# EAGLE design mainboard (EAGLE 6.4)
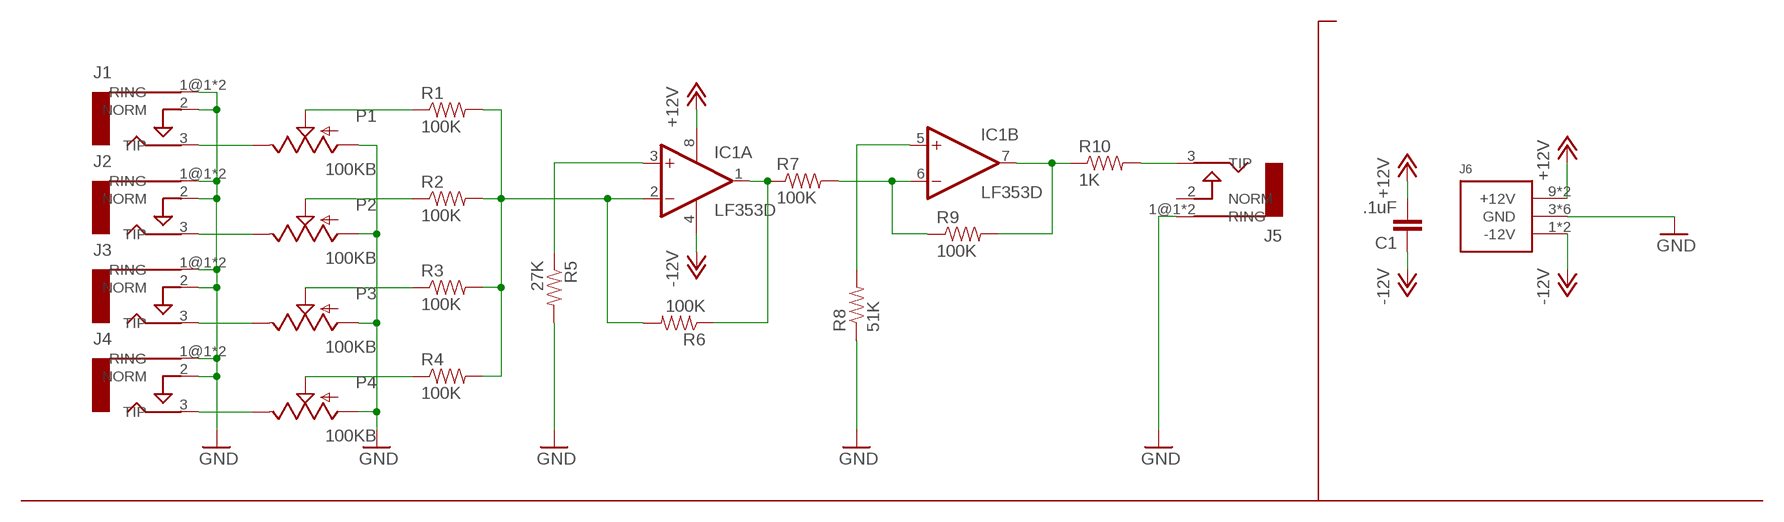
[diagram p0: schematic, sheet 1]

## Parts
C1  .1uF  CAP0603-CAP  [0603-CAP]
IC1  LF353D  [SO08]
J1  AUDIO-JACKERTHENVAR  [ERTHENVAR-JACK]
J2  AUDIO-JACKERTHENVAR  [ERTHENVAR-JACK]
J3  AUDIO-JACKERTHENVAR  [ERTHENVAR-JACK]
J4  AUDIO-JACKERTHENVAR  [ERTHENVAR-JACK]
J5  AUDIO-JACKERTHENVAR  [ERTHENVAR-JACK]
J6  POWER_SIMPLE16  [POWER_16]
P1  100KB  POTPDB12  [PDB12]
P2  100KB  POTPDB12  [PDB12]
P3  100KB  POTPDB12  [PDB12]
P4  100KB  POTPDB12  [PDB12]
R1  100K  1.2MOHMS-1/10W-1%(0603)  [0603-RES]
R2  100K  1.2MOHMS-1/10W-1%(0603)  [0603-RES]
R3  100K  1.2MOHMS-1/10W-1%(0603)  [0603-RES]
R4  100K  1.2MOHMS-1/10W-1%(0603)  [0603-RES]
R5  27K  1.2MOHMS-1/10W-1%(0603)  [0603-RES]
R6  100K  1.2MOHMS-1/10W-1%(0603)  [0603-RES]
R7  100K  1.2MOHMS-1/10W-1%(0603)  [0603-RES]
R8  51K  1.2MOHMS-1/10W-1%(0603)  [0603-RES]
R9  100K  1.2MOHMS-1/10W-1%(0603)  [0603-RES]
R10  1K  1.2MOHMS-1/10W-1%(0603)  [0603-RES]

## Nets
+12V: C1.2 IC1.8(P:V+) J6.9(+12V) J6.10(+12V)
-12V: C1.1 IC1.4(P:V-) J6.1(-12V) J6.2(-12V)
GND: J1.1@1(RING) J1.1@2(RING) J1.2(NORM) J2.1@1(RING) J2.1@2(RING) J2.2(NORM) J3.1@1(RING) J3.1@2(RING) J3.2(NORM) J4.1@1(RING) J4.1@2(RING) J4.2(NORM) J5.1@1(RING) J5.1@2(RING) J6.3(GND) J6.4(GND) J6.5(GND) J6.6(GND) J6.7(GND) J6.8(GND) P1.1(A) P2.1(A) P3.1(A) P4.1(A) R5.2 R8.1
J1: J1.3(TIP) P1.3(E)
N$1: J3.3(TIP) P3.3(E)
N$2: J2.3(TIP) P2.3(E)
N$3: J5.3(TIP) R10.2
N$4: P1.2(S) R1.1
N$5: P2.2(S) R2.1
N$6: J4.3(TIP) P4.3(E)
N$7: P3.2(S) R3.1
N$8: IC1.1(A:OUT) R6.1 R7.1
N$9: IC1.3(A:+IN) R5.1
N$10: P4.2(S) R4.1
N$11: IC1.2(A:-IN) R1.2 R2.2 R3.2 R4.2 R6.2
N$12: IC1.7(B:OUT) R9.2 R10.1
N$14: IC1.6(B:-IN) R7.2 R9.1
N$15: IC1.5(B:+IN) R8.2
Unconnected: J5.2(NORM)

## Library data of the parts
C1 = SparkFun:CAP: Capacitor Standard 0603 ceramic capacitor, and 0.1" leaded capacitor.
IC1 = linear:LF353: OP AMP
J1-J5 = erthenvar:AUDIO-JACK: Switching Mono 3.5mm Audio Jack from Erthenvar.
J6 = eurorack:POWER_SIMPLE
P1-P4 = SparkFun:POT
R1-R10 = SparkFun-Resistors:1.2MOHMS-1/10W-1%(0603): RES-10055; PROD_ID: RES-10055; VALUE: 1.2M

## Board
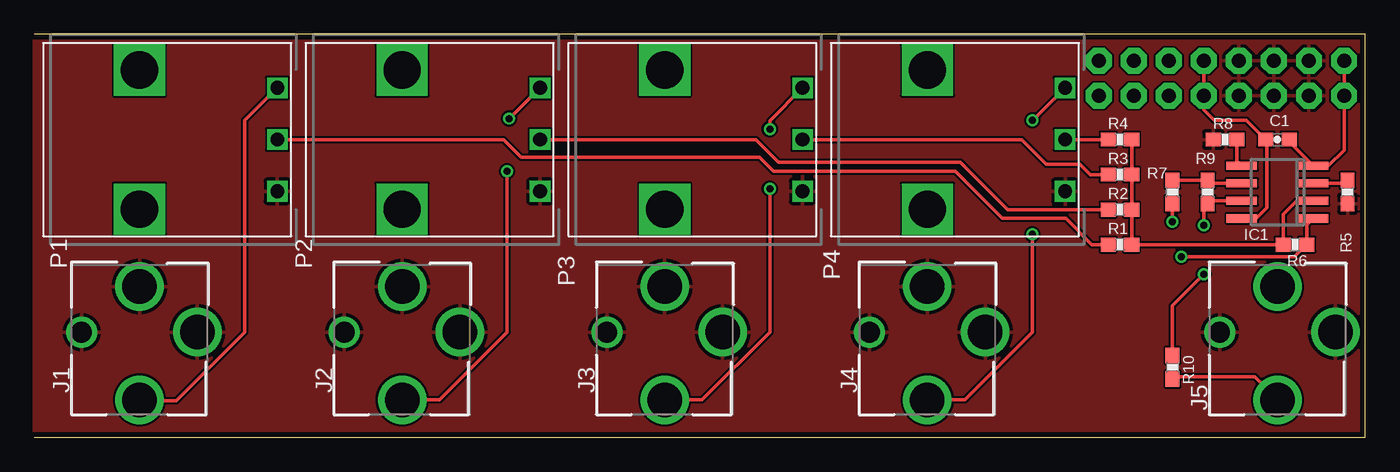
[diagram p1: board, top side]
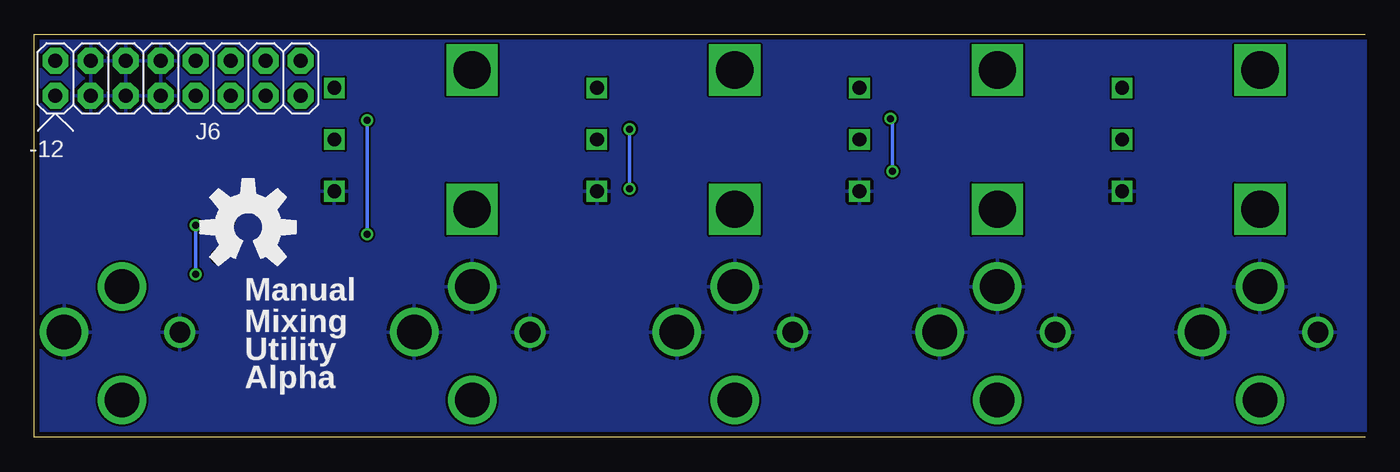
[diagram p2: board, bottom side, seen from below]

Size 96.52 x 29.21 mm. Coordinates in mm from the lower left corner, seen from the top.
Outline: 0,0 96.52,0 96.52,29.21 0,29.21
Copper layers (1*16): Top 0.0356mm / dielectric 1.5011mm / Bottom 0.0356mm
Design rules "LaenPCBOrder": minimum track width 6mil, minimum drill 13mil, track to track 6mil, track to pad 6mil, pad to pad 6mil, via to via 6mil, smd to smd 6mil, copper to edge 15mil, drill to drill 6mil, minimum pad ring 7mil, minimum via ring 7mil, stop-mask expansion 4mil, vias tented up to drill 0mil, thermal gap 10mil

### Footprints (pad centres in the part's own frame; a part is rotated, then mirrored left to right if it is on the bottom)
0603-CAP = smd 1.1 x 1: 1 -0.85,0; 2 0.85,0
SO08 = smd 0.6 x 2.2: 1 -1.905,-2.6; 2 -0.635,-2.6; 3 0.635,-2.6; 4 1.905,-2.6; 5 1.905,2.6; 6 0.635,2.6; 7 -0.635,2.6; 8 -1.905,2.6
ERTHENVAR-JACK = drill 2.5: 1@1 -4.2,0; 2 0,-3.3; 3 0,4.9 | drill 1.5: 1@2 4.2,0
POWER_16 = drill 1.016 pad 1.88 octagon: 1 -6.35,-1.27; 2 -6.35,1.27; 3 -3.81,-1.27; 4 -3.81,1.27; 5 -1.27,-1.27; 6 -1.27,1.27; 7 1.27,-1.27; 8 1.27,1.27; 9 3.81,-1.27; 10 3.81,1.27; 11 6.35,-1.27; 12 6.35,1.27; 13 8.89,-1.27; 14 8.89,1.27; 15 11.43,-1.27; 16 11.43,1.27
PDB12 = drill 1 square: 1 -3.75,-10; 2 0,-10; 3 3.75,-10 | drill 2.7 square: P$4 5.05,0; P$5 -5.05,0
0603-RES = smd 1.1 x 1: 1 -0.85,0; 2 0.85,0

### Placement (x,y rotation side)
C1  90.17,21.59 180 top
IC1  90.17,17.78 90 top
J1  7.62,7.62 180 top
J2  26.67,7.62 180 top
J3  45.72,7.62 180 top
J4  64.77,7.62 180 top
J5  90.17,7.62 180 top
J6  88.65,26.04 0 bottom
P1  7.62,21.59 90 top
P2  26.67,21.59 90 top
P3  45.72,21.59 90 top
P4  64.77,21.59 90 top
R1  78.74,13.97 0 top
R2  78.74,16.51 0 top
R3  78.74,19.05 0 top
R4  78.74,21.59 0 top
R5  95.25,17.78 270 top
R6  91.44,13.97 180 top
R7  82.55,17.78 90 top
R8  86.36,21.59 0 top
R9  85.09,17.78 270 top
R10  82.55,5.08 270 top
U$1  [OSHW-LOGO-L]  81.03,15.24 0 bottom

### Tracks (layer width: path | path; a pad name or v marks a point on that pad's centre or on a via)
+12V
  Top 0.254: J6.10 J6.9 84.84,23.75 85.6,22.99 87.92,22.99 C1.2 89.41,21.5 89.41,16.64 88.65,15.88 IC1.8
-12V
  Top 0.254: J6.2 J6.1 95,20.83 93.85,19.68 IC1.4 91.02,21.43 C1.1
GND
  pour Bottom: 0,29.21 96.52,29.21 96.52,0 0,0
  pour Top: 0,29.21 96.52,29.21 96.52,0 0,0
J1
  Top 0.254: P1.3 17.59,25.34 15.24,22.99 15.24,7.62 10.29,2.67 7.67,2.67 J1.3
N$1  (via drill 0.51)
  Top 0.254: J3.3 48.44,2.72 53.34,7.62 v53.34,18.03 | v53.34,22.35 53.34,22.96 P3.3
  Bottom 0.254: v53.34,18.03 v53.34,22.35
N$2  (via drill 0.51)
  Top 0.254: J2.3 29.39,2.72 34.29,7.62 v34.29,19.3 | v34.42,23.11 34.44,23.11 P2.3
  Bottom 0.254: v34.29,19.3 34.29,22.99 v34.42,23.11
N$3
  Top 0.254: J5.3 88.52,4.37 82.69,4.37 R10.2
N$4
  Top 0.254: P1.2 34.04,21.59 35.31,20.32 52.58,20.32 53.59,19.3 66.8,19.3 70.23,15.88 74.8,15.88 76.71,13.97 R1.1
N$5
  Top 0.254: P2.2 52.32,21.59 53.98,19.94 67.18,19.94 70.61,16.51 R2.1
N$6  (via drill 0.51)
  Top 0.254: J4.3 67.49,2.72 72.39,7.62 v72.39,14.73 | v72.39,22.99 72.42,22.99 P4.3
  Bottom 0.254: v72.39,14.73 v72.39,22.99
N$7
  Top 0.254: P3.2 71.63,21.59 73.41,19.81 75.82,19.81 76.58,19.05 R3.1
N$8  (via drill 0.51)
  Top 0.254: IC1.1 92.29,15.39 R6.1 91.4,13.08 v83.19,13.08 | R7.1 v82.55,15.62
  Bottom 0.254: v82.55,15.62 82.55,13.72 v83.19,13.08
N$9
  Top 0.254: IC1.3 95.03,18.41 R5.1
N$10
  Top 0.254: R4.1 P4.2
N$11
  Top 0.254: R4.2 R3.2 R2.2 R1.2 R6.2 90.59,16.17 91.57,17.14 IC1.2
N$12  (via drill 0.51)
  Top 0.254: IC1.7 85.31,17.14 R9.2 84.84,16.68 v84.84,15.37 | R10.1 82.55,9.53 v84.84,11.81
  Bottom 0.254: v84.84,11.81 v84.84,15.37
N$14
  Top 0.254: IC1.6 85.31,18.41 R9.1 R7.2
N$15
  Top 0.254: R8.2 87.21,20.05 IC1.5

### Text on the board
bPlace: Manual | Mixing | Utility | Alpha